# EAGLE design water_controller (EAGLE 6.4)
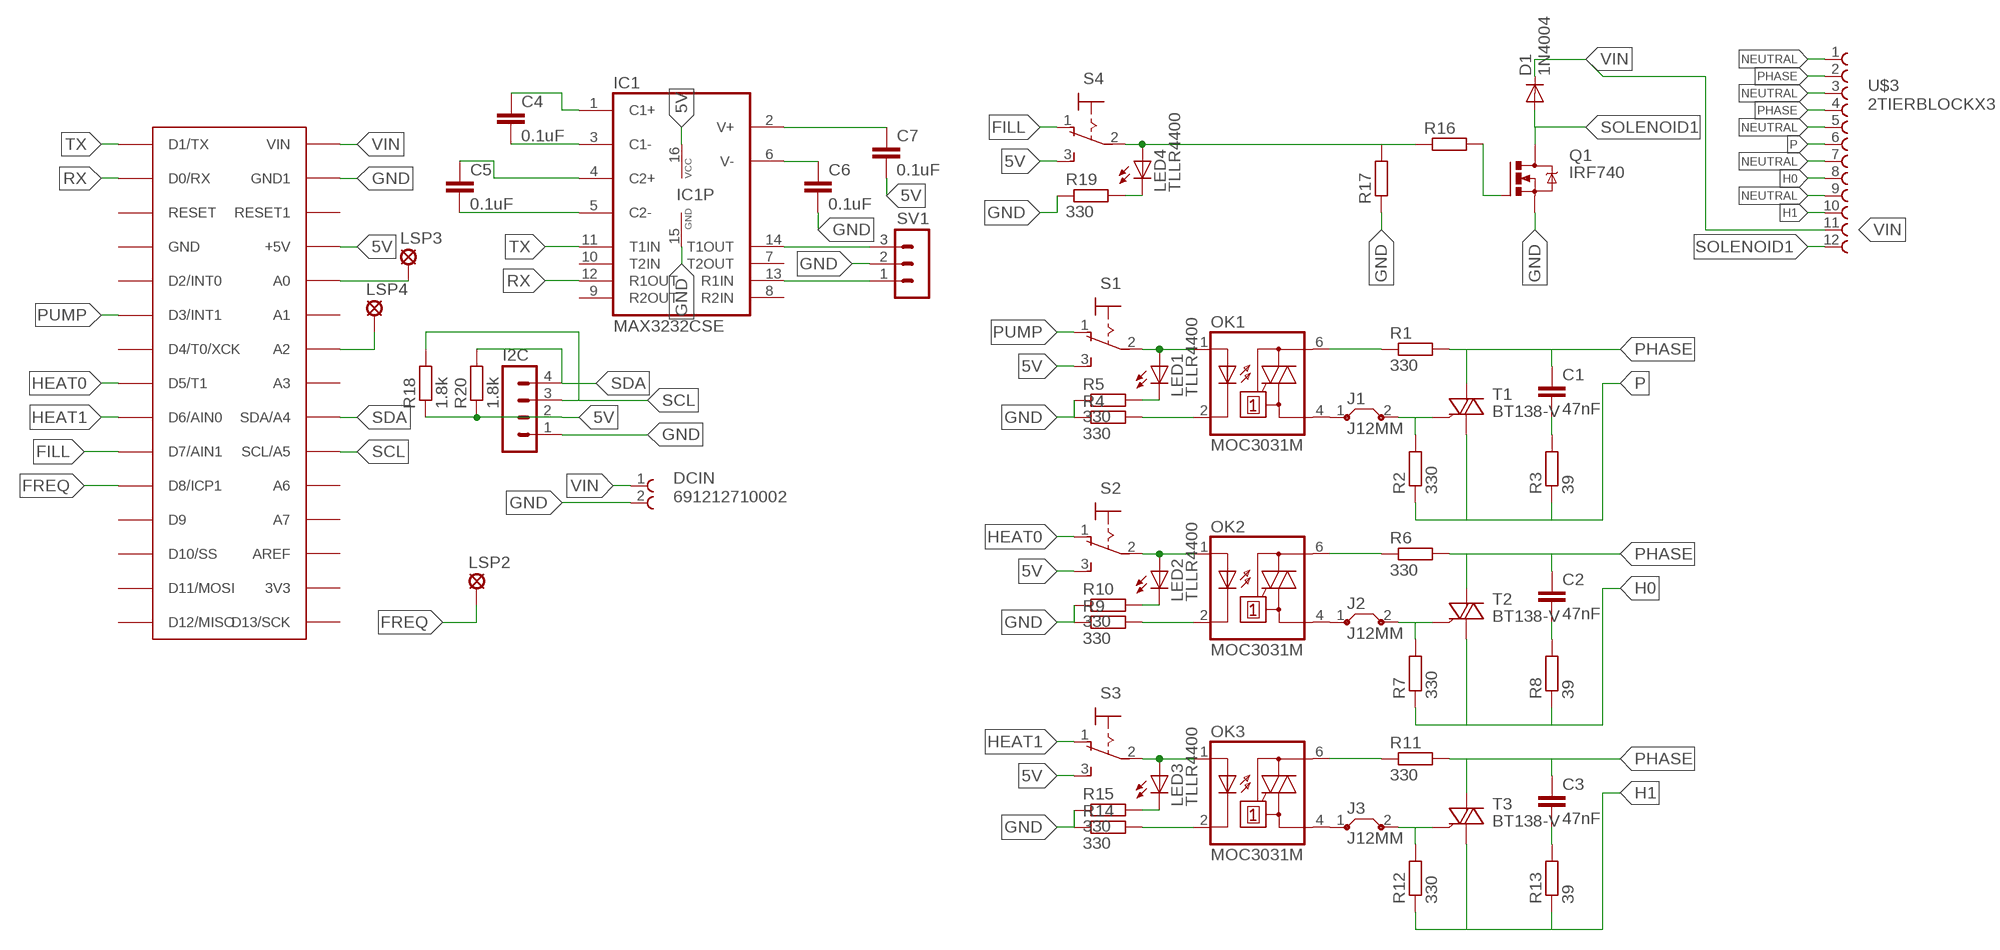
[diagram p0: schematic, sheet 1]

## Parts
C1  47nF  C-EU150-064X183  [C150-064X183]
C2  47nF  C-EU150-064X183  [C150-064X183]
C3  47nF  C-EU150-064X183  [C150-064X183]
C4  0.1uF  C-EUC0805  [C0805]
C5  0.1uF  C-EUC0805  [C0805]
C6  0.1uF  C-EUC0805  [C0805]
C7  0.1uF  C-EUC0805  [C0805]
D1  1N4004  [DO41-10]
DCIN  691212710002  [691212710002]
I2C  MA04-1  [MA04-1]
IC1  MAX3232CSE  [SO16]
J1  J12MM  [12]
J2  J12MM  [12]
J3  J12MM  [12]
LED1  TLLR4400  [LED3MM]
LED2  TLLR4400  [LED3MM]
LED3  TLLR4400  [LED3MM]
LED4  TLLR4400  [LED3MM]
LSP2  LSP11  [LSP11]
LSP3  LSP11  [LSP11]
LSP4  LSP11  [LSP11]
OK1  MOC3031M  [DIL06]
OK2  MOC3031M  [DIL06]
OK3  MOC3031M  [DIL06]
Q1  IRF740  [TO220BV]
R1  330  R-EU_M1206  [M1206]
R2  330  R-EU_M1206  [M1206]
R3  39  R-EU_M1206  [M1206]
R4  330  R-EU_R1206  [R1206]
R5  330  R-EU_R1206  [R1206]
R6  330  R-EU_M1206  [M1206]
R7  330  R-EU_M1206  [M1206]
R8  39  R-EU_M1206  [M1206]
R9  330  R-EU_R1206  [R1206]
R10  330  R-EU_R1206  [R1206]
R11  330  R-EU_M1206  [M1206]
R12  330  R-EU_M1206  [M1206]
R13  39  R-EU_M1206  [M1206]
R14  330  R-EU_R1206  [R1206]
R15  330  R-EU_R1206  [R1206]
R16  R-EU_0204/7  [0204/7]
R17  R-EU_M1206  [M1206]
R18  1.8k  R-EU_R1206  [R1206]
R19  330  R-EU_R1206  [R1206]
R20  1.8k  R-EU_R1206  [R1206]
S1  M9040P  [M9040P]
S2  M9040P  [M9040P]
S3  M9040P  [M9040P]
S4  M9040P  [M9040P]
SV1  MA03-1  [MA03-1]
T1  BT138-V  [TO220BV]
T2  BT138-V  [TO220BV]
T3  BT138-V  [TO220BV]
U$1  ARDUINONANO  [PDIP-32]
U$3  2TIERBLOCKX3  [2TIERX3]

## Nets
5V: C7.2 I2C.2 IC1.16(VCC) R18.1 R20.1 S1.3(S) S2.3(S) S3.3(S) S4.3(S) U$1.+5V
FILL: S4.1(O) U$1.D7(D7/AIN1)
FREQ: LSP2.MP U$1.D8(D8/ICP1)
GND: C6.2 DCIN.2 I2C.1 IC1.15(GND) Q1.S R4.1 R5.1 R9.1 R10.1 R14.1 R15.1 R17.1 R19.1 SV1.2 U$1.GND1
H0: R7.1 R8.1 T2.T1(A1) U$3.8
H1: R12.1 R13.1 T3.T1(A1) U$3.10
HEAT0: S2.1(O) U$1.D5(D5/T1)
HEAT1: S3.1(O) U$1.D6(D6/AIN0)
N$1: C1.2 R3.2
N$2: C2.2 R8.2
N$3: OK1.6(A2) R1.1
N$4: J1.2 R2.2 T1.G
N$5: C4.2 IC1.3(C1-)
N$6: OK1.2(C) R4.2
N$7: LED1.A OK1.1(A) S1.2(P)
N$8: LED1.K(C) R5.2
N$9: C4.1 IC1.1(C1+)
N$10: OK2.6(A2) R6.1
N$11: J2.2 R7.2 T2.G
N$12: OK2.2(C) R9.2
N$13: LED2.A OK2.1(A) S2.2(P)
N$14: LED2.K(C) R10.2
N$15: C3.2 R13.2
N$16: OK3.6(A2) R11.1
N$17: J3.2 R12.2 T3.G
N$18: OK3.2(C) R14.2
N$19: LED3.A OK3.1(A) S3.2(P)
N$20: LED3.K(C) R15.2
N$21: C5.2 IC1.5(C2-)
N$22: Q1.G R16.2
N$23: C5.1 IC1.4(C2+)
N$24: LED4.A R16.1 R17.2 S4.2(P)
N$25: LED4.K(C) R19.2
N$26: C6.1 IC1.6(V-)
N$27: C7.1 IC1.2(V+)
N$28: J1.1 OK1.4(A1)
N$29: J2.1 OK2.4(A1)
N$30: J3.1 OK3.4(A1)
N$31: IC1.13(R1IN) SV1.1
N$32: IC1.14(T1OUT) SV1.3
N$33: LSP4.MP U$1.A2
N$34: LSP3.MP U$1.A0
NEUTRAL: U$3.1 U$3.3 U$3.5 U$3.7 U$3.9
P: R2.1 R3.1 T1.T1(A1) U$3.6
PHASE: C1.1 C2.1 C3.1 R1.2 R6.2 R11.2 T1.T2(A2) T2.T2(A2) T3.T2(A2) U$3.2 U$3.4
PUMP: S1.1(O) U$1.D3(D3/INT1)
RX: IC1.12(R1OUT) U$1.D0/RX
SCL: I2C.3 R18.2 U$1.A5(SCL/A5)
SDA: I2C.4 R20.2 U$1.A4(SDA/A4)
SOLENOID1: D1.A Q1.D U$3.12
TX: IC1.11(T1IN) U$1.D1/TX
VIN: D1.C DCIN.1 U$1.VIN U$3.11
Unconnected: IC1.7(T2OUT) IC1.8(R2IN) IC1.9(R2OUT) IC1.10(T2IN) U$1.3V3 U$1.A1 U$1.A3 U$1.A6 U$1.A7 U$1.AREF U$1.D2(D2/INT0) U$1.D4(D4/T0/XCK) U$1.D9 U$1.D10(D10/SS) U$1.D11(D11/MOSI) U$1.D12(D12/MISO) U$1.D13(D13/SCK) U$1.GND U$1.RESET U$1.RESET1

## Library data of the parts
C1-C7 = rcl:C-EU: CAPACITOR, European symbol
D1 = diode:1N4004: DIODE general purpose rectifier, 1 A
DCIN = ZugbuegelsystemWR-TBL:691212710002: WR-TBL Serie 212 - 5.0mm 45° Entry Modular with Rising Cage Clamp - 3.5mm2 Wires, 2 Pins
I2C = con-lstb:MA04-1: PIN HEADER; OC_FARNELL: unknown; OC_NEWARK: unknown
IC1 = maxim:MAX3232*: True RS-232 Transceivers 3.0V to 5.5V, Low-Power up to 1Mbps, Using Four 0.1µF External Capacitors Source: http://pdfserv.maxim-ic.com/en/ds/MAX3222-MAX3241.pdf; MPN: MAX3232CSE; OC_FARNELL: 9725490; OC_NEWARK: 90C2890
J1-J3 = jumper:J: Bridge
LED1-LED4 = led:TLLR4400: Low Current (2mA) LED 3 mm Tinted Diffused Package color RED Source: Data sheet <http://www.farnell.com/datasheets/391100.pdf>; MF: VISHAY SEMICONDUCTOR; OC_FARNELL: 1612437
LSP2-LSP4 = solpad:LSP11: SOLDER PAD drill 1.1 mm
OK1-OK3 = optocoupler:MOC30*: 6-Pin DIP Zero-Cross Optoisolators Triac Driver Output (250/400 Volt Peak) Source: http://www.fairchildsemi.com/ds/MO/MOC3043-M.pdf; MF: FAIRCHILD SEMICONDUCTOR; MPN: MOC3063; OC_FARNELL: 9875964; OC_NEWARK: 78K6089
Q1 = transistor-power:IRF740: N-CHANNEL MOS FET
R1-R17 R19 = rcl:R-EU_: RESISTOR, European symbol
R18 R20 = resistor:R-EU_: RESISTOR, European symbol
S1-S4 = switch:M9040P: TOGGLE SWITCH Marquardt
SV1 = con-lstb:MA03-1: PIN HEADER; OC_FARNELL: unknown; OC_NEWARK: unknown
T1-T3 = triac:BT138: TRIAC Source: http://www.semiconductors.philips.com BT138_SERIES_2.pdf
U$1 = jet-lib:ARDUINONANO
U$3 = jet-lib:2TIERBLOCKX3

## Board
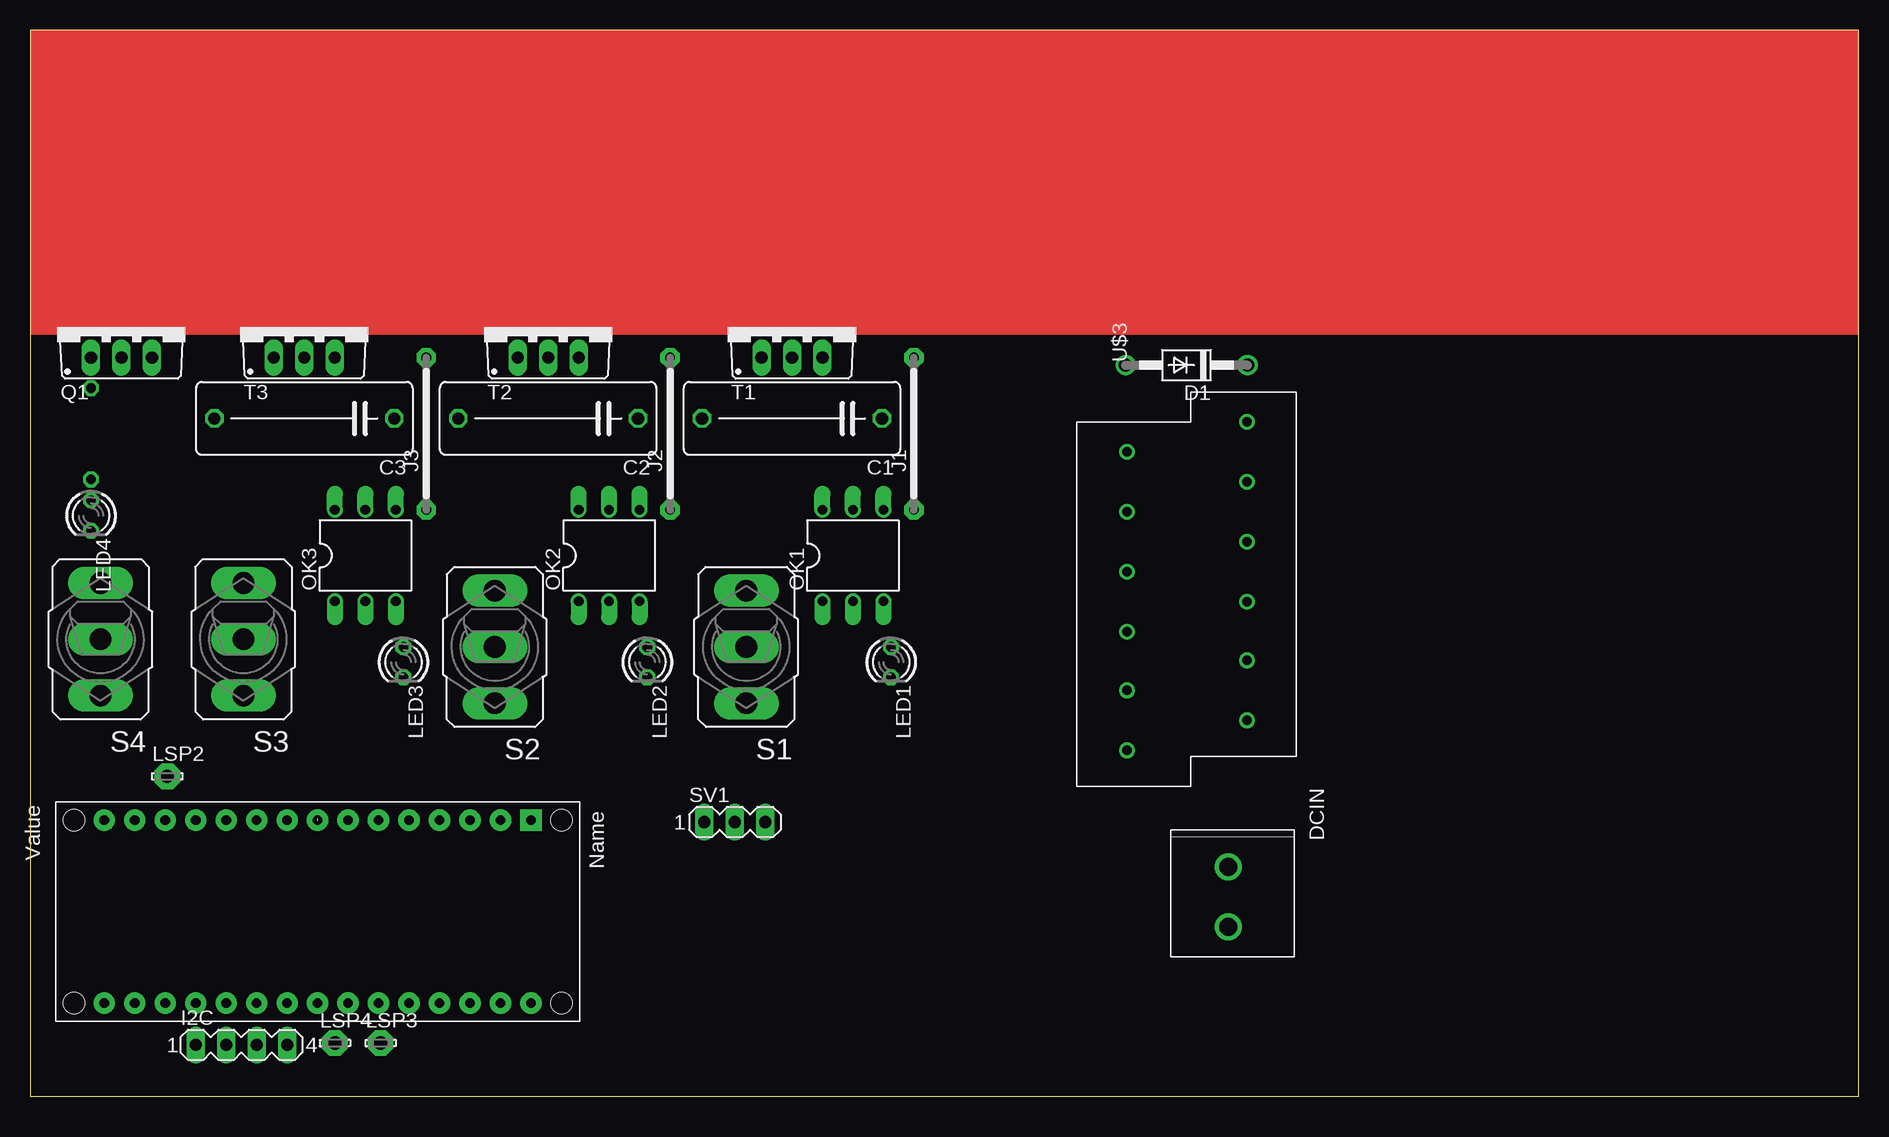
[diagram p1: board, top side]
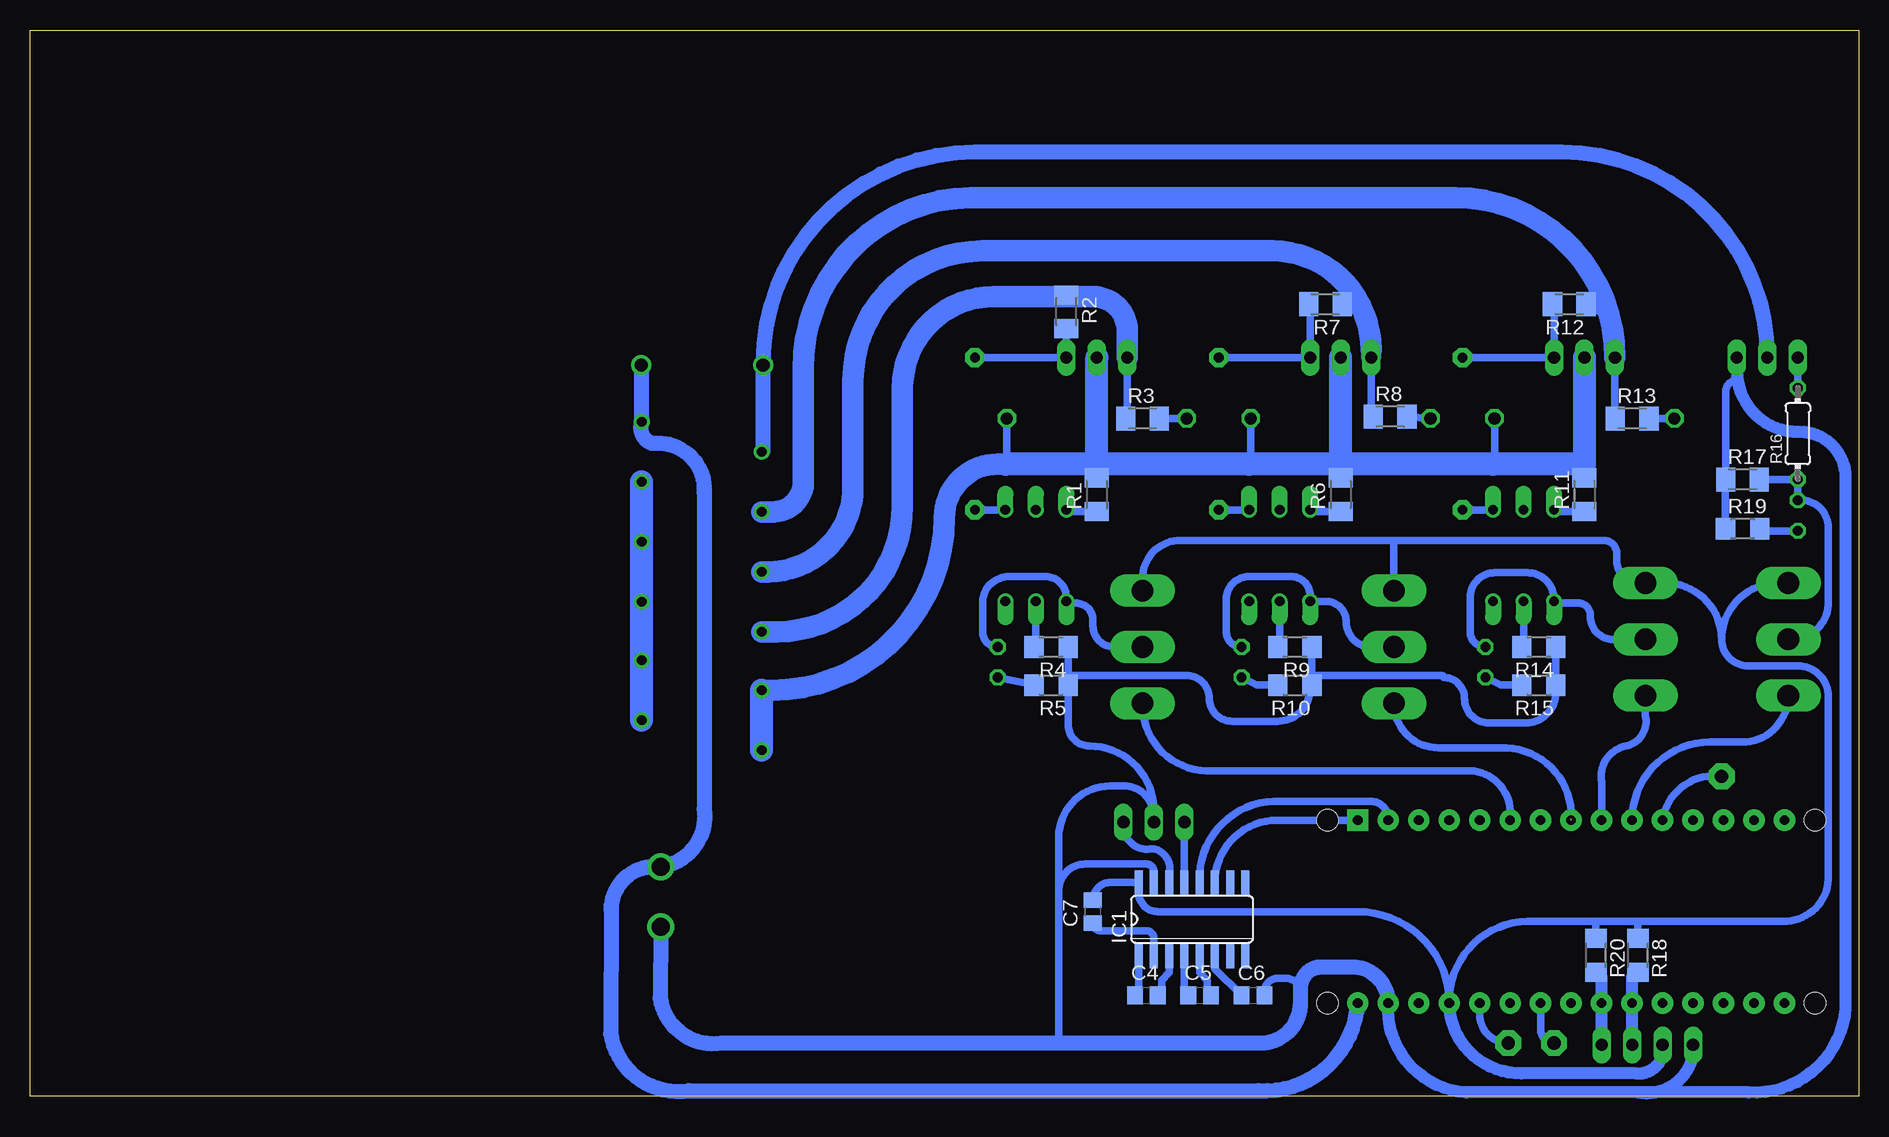
[diagram p2: board, bottom side, seen from below]

Size 152.4 x 88.9 mm. Coordinates in mm from the lower left corner, seen from the top.
Outline: 0,0 152.4,0 152.4,88.9 0,88.9 0,0
Copper layers (1*16): Top 0.035mm / dielectric 1.5mm / Bottom 0.035mm
Design rules "default": minimum track width 10mil, minimum drill 24mil, track to track 8mil, track to pad 8mil, pad to pad 8mil, via to via 8mil, smd to smd 8mil, copper to edge 40mil, drill to drill 8mil, minimum pad ring 10mil, minimum via ring 8mil, stop-mask expansion 4mil, vias tented up to drill 0mil, thermal gap 10mil

### Footprints (pad centres in the part's own frame; a part is rotated, then mirrored left to right if it is on the bottom)
C150-064X183 = drill 1.016 octagon: 1 -7.493,0; 2 7.493,0
C0805 = smd 1.3 x 1.5: 1 -0.95,0; 2 0.95,0
DO41-10 = drill 1.118: A 5.08,0; C -5.08,0
691212710002 = drill 1.5: 1 -5,0; 2 0,0
MA04-1 = drill 1.016 long: 1 -3.81,0; 2 -1.27,0; 3 1.27,0; 4 3.81,0
SO16 = smd 0.66 x 2.032: 1 -4.445,-3.073; 2 -3.175,-3.073; 3 -1.905,-3.073; 4 -0.635,-3.073; 5 0.635,-3.073; 6 1.905,-3.073; 7 3.175,-3.073; 8 4.445,-3.073; 9 4.445,3.073; 10 3.175,3.073; 11 1.905,3.073; 12 0.635,3.073; 13 -0.635,3.073; 14 -1.905,3.073; 15 -3.175,3.073; 16 -4.445,3.073
12 = drill 0.813 pad 1.6 octagon: 1 -6.35,0; 2 6.35,0
LED3MM = drill 0.813 octagon: A -1.27,0; K 1.27,0
LSP11 = drill 1.118 pad 2.159 octagon: MP 0,0
DIL06 = drill 0.813 offset: 1 -2.54,-3.81; 2 0,-3.81; 3 2.54,-3.81; 4 2.54,3.81; 5 0,3.81; 6 -2.54,3.81
TO220BV = drill 1.016 long: D 0,-2.54; G -2.54,-2.54; S 2.54,-2.54
M1206 = smd 1.6 x 2: 1 -1.4,0; 2 1.4,0
R1206 = smd 1.6 x 1.803: 1 -1.422,0; 2 1.422,0
0204/7 = drill 0.813 octagon: 1 -3.81,0; 2 3.81,0
M9040P = drill 1.803 long: 1 0,4.699; 2 0,0; 3 0,-4.699
MA03-1 = drill 1.016 long: 1 -2.54,0; 2 0,0; 3 2.54,0
TO220BV' = drill 1.016 long: G 2.54,-2.54; T1 -2.54,-2.54; T2 0,-2.54
PDIP-32 = drill 0.8 pad 1.778: 3V3 15.24,-35.56; +5V 15.24,-10.16; A0 15.24,-12.7; A1 15.24,-15.24; A2 15.24,-17.78; A3 15.24,-20.32; A4 15.24,-22.86; A5 15.24,-25.4; A6 15.24,-27.94; A7 15.24,-30.48; AREF 15.24,-33.02; D0/RX 0,-5.08; D2 0,-12.7; D3 0,-15.24; D4 0,-17.78; D5 0,-20.32; D6 0,-22.86; D7 0,-25.4; D8 0,-27.94; D9 0,-30.48; D10 0,-33.02; D11 0,-35.56; D12 0,-38.1; D13 15.24,-38.1; GND 0,-10.16; GND1 15.24,-5.08; RESET 0,-7.62; RESET1 15.24,-7.62; VIN 15.24,-2.54 | drill 0.8 pad 1.778 square: D1/TX 0,-2.54 | hole 1.778: 0,0; 0,-40.64; 15.24,-40.64; 15.24,0
2TIERX3 = drill 0.8: 1 0,0; 2 -2.5,10; 3 5,0; 4 2.5,10; 5 9.88,0; 6 7.38,10; 7 14.88,0; 8 12.38,10; 9 19.88,0; 10 17.38,10; 11 24.88,0; 12 22.38,10

### Placement (x,y rotation side)
C1  63.5,56.52 180 top
C2  43.18,56.52 180 top
C3  22.86,56.52 180 top
C4  59.37,8.41 0 bottom
C5  54.93,8.41 0 bottom
C6  50.48,8.41 0 bottom
C7  63.82,15.4 90 bottom
D1  96.38,60.96 180 top
DCIN  99.85,14.13 270 top
I2C  17.62,4.29 0 top
IC1  55.56,14.76 0 bottom
J1  73.66,55.24 90 top
J2  53.34,55.24 90 top
J3  33.02,55.24 90 top
LED1  71.75,36.2 270 top
LED2  51.44,36.2 270 top
LED3  31.11,36.2 270 top
LED4  5.08,48.42 270 top
LSP2  11.43,26.67 0 top
LSP3  29.21,4.45 0 top
LSP4  25.4,4.45 0 top
OK1  68.58,45.09 0 top
OK2  48.26,45.09 0 top
OK3  27.94,45.09 0 top
Q1  7.62,64.14 0 top
R1  63.5,50.16 90 bottom
R2  66.04,65.41 270 bottom
R3  59.69,56.52 0 bottom
R4  67.31,37.47 180 bottom
R5  67.31,34.29 180 bottom
R6  43.18,50.16 90 bottom
R7  44.45,66.04 180 bottom
R8  39.05,56.67 0 bottom
R9  46.99,37.47 180 bottom
R10  46.99,34.29 180 bottom
R11  22.86,50.16 90 bottom
R12  24.13,66.04 180 bottom
R13  18.89,56.52 0 bottom
R14  26.67,37.47 180 bottom
R15  26.67,34.29 180 bottom
R16  5.08,55.24 90 bottom
R17  9.68,51.44 0 bottom
R18  18.41,11.75 270 bottom
R19  9.68,47.31 0 bottom
R20  21.91,11.75 270 bottom
S1  59.69,37.47 180 top
S2  38.73,37.47 180 top
S3  17.78,38.1 180 top
S4  5.87,38.1 180 top
SV1  58.74,22.86 0 top
T1  BT138-V  [TO220BV']  63.5,64.14 0 top
T2  BT138-V  [TO220BV']  43.18,64.14 0 top
T3  BT138-V  [TO220BV']  22.86,64.14 0 top
U$1  44.29,23.02 270 top
U$3  101.42,31.34 90 top

### Tracks (layer width: path | path; a pad name or v marks a point on that pad's centre or on a via)
5V
  Bottom 0.61: S1.3 59.69,43.18 arc90 56.52,46.35 38.73,46.35 | S2.3 38.73,46.35 | 11.43,38.1 arc-90 16.13,42.8 S3.3 18.35,42.8 arc90 20.16,44.61 20.16,45.24 arc-90 21.27,46.35 38.73,46.35 | 11.43,38.1 arc-90 9.21,35.88 5.08,35.88 arc90 2.54,33.34 2.54,18.1 arc90 6.35,14.61 18.73,14.61 | 18.73,14.61 21.91,14.61 | 21.91,14.61 27.62,14.61 arc-90 U$1.+5V arc-90 41.75,15.4 58.42,15.4 arc90 60.01,16.99 IC1.16 62.33,17.84 arc-90 C7.2 | S4.3 6.73,42.8 arc-90 11.43,38.1 | R18.1 18.41,14.29 arc-90 18.73,14.61 | R20.1 21.91,14.61
  Bottom 1.016: I2C.2 16.35,3.65 arc90 18.57,1.91 28.1,1.91 arc90 U$1.+5V
FILL
  Bottom 0.61: U$1.D7 arc90 12.38,29.53 9.75,29.53 arc-90 S4.1
FREQ
  Bottom 0.61: U$1.D8 U$1.D8 arc90 LSP2.MP
GND
  Bottom 0.61: 65.89,35.08 R4.1 65.41,37.47 | 65.89,35.08 R5.1 65.89,33.66 arc-90 65.88,33.66 65.88,30.96 arc-90 64.14,29.21 arc90 58.74,23.81 SV1.2 58.74,23.34 arc-90 61.28,25.88 62.39,25.88 arc-90 66.67,21.59 66.67,17.14 | 45.57,35.08 R9.1 45.09,37.47 | 45.57,35.08 R10.1 45.72,34.14 45.72,33.97 arc90 48.42,31.27 52.23,31.27 arc90 54.13,33.18 arc-90 56.04,35.08 65.89,35.08 | 25.4,34.14 R15.1 | R15.1 25.24,33.66 arc90 27.78,31.11 30.8,31.11 arc90 32.86,33.18 arc-90 34.61,34.92 arc-90 34.77,35.08 45.57,35.08 | R15.1 R14.1 | R19.1 arc90 R19.1 11.11,51.12 arc-90 11.08,51.15 R17.1 11.08,58.77 arc90 10.16,59.69 10.16,60.48 | 66.67,17.14 66.67,4.6 arc-90 66.52,4.45 | IC1.15 58.74,18.73 arc-90 59.37,19.37 64.45,19.37 arc-90 66.67,17.14 | C6.2 49.53,8.73 arc90 48.42,9.84 47.78,9.84 arc90 46.51,8.57
  Bottom 1.016: I2C.1 13.81,3.49 arc90 18.41,0.32 | 18.41,0.32 32.7,0.32 arc90 U$1.GND1 | Q1.S 10.16,60.48 arc-90 5.08,55.4 4.92,55.4 arc90 1.11,51.59 1.11,7.46 arc90 9.21,0.32 18.41,0.32
  Bottom 1.27: DCIN.2 99.89,8.19 arc-90 94.77,4.45 66.52,4.45 49.85,4.45 arc-90 46.51,7.78 46.51,8.57 46.51,9.05 arc90 44.77,10.79 42.23,10.79 arc90 U$1.GND1
H0
  Bottom 0.61: T2.T1 40.64,57.02 R8.1
  Bottom 1.27: 40.64,62.23 40.64,63.63 arc-90 R7.1
  Bottom 1.676: T2.T1 40.64,62.23
  Bottom 1.778: U$3.8 90.89,43.73 arc-90 83.82,50.8 83.82,59.69 arc90 73.03,70.48 48.9,70.48 arc90 40.64,62.23
H1
  Bottom 0.61: T3.T1 20.32,57.02 R13.1
  Bottom 1.27: 21.27,66.36 arc90 21.59,66.04 R12.1 arc90 20.32,63.63 T3.T1
  Bottom 1.778: U$3.10 90.66,48.73 arc-90 87.95,51.12 87.95,60.64 arc90 73.98,74.93 33.66,74.93 arc90 T3.T1
HEAT0  (1 unrouted)
  Bottom 0.61: 23.97,23.18 arc-90 29.37,29.05 35.02,29.05 arc90 S2.1
HEAT1
  Bottom 0.61: S3.1 17.78,31.75 arc90 19.37,29.21 arc-90 21.43,26.19 U$1.D6
N$1
  Bottom 0.61: C1.2 R3.2
N$2
  Bottom 0.61: R8.2 C2.2
N$3
  Bottom 0.61: R1.1 66.04,48.77 OK1.6
N$4
  Bottom 0.61: R2.2 T1.G J1.2
N$5
  Bottom 0.305: 58.1,8.73 C4.2
  Bottom 0.61: IC1.3 57.47,10.32 58.1,9.68 58.1,8.73
N$6
  Bottom 0.61: OK1.2 68.58,37.62 R4.2
N$7
  Bottom 0.61: LED1.A arc90 73.03,38.73 73.03,41.12 arc90 70.8,43.34 67.79,43.34 arc90 66.04,41.59 OK1.1 arc-90 65.88,41.12 65.25,41.12 arc90 63.82,39.69 63.82,39.21 arc-90 62.07,37.47 S1.2
N$8
  Bottom 0.61: LED1.K R5.2
N$9
  Bottom 0.305: 60.01,8.73 C4.1
  Bottom 0.61: IC1.1 60.01,8.73
N$10
  Bottom 0.61: R6.1 45.59,48.77 OK2.6
N$11
  Bottom 0.61: J2.2 T2.G 45.72,65.91 R7.2
N$12
  Bottom 0.61: OK2.2 48.26,37.62 R9.2
N$13
  Bottom 0.61: S2.2 40.64,37.47 arc90 42.7,39.53 arc-90 44.45,41.27 OK2.1 45.72,41.75 arc-90 47.31,43.34 50.8,43.34 arc-90 52.7,41.43 52.7,38.73 arc-90 LED2.A
N$14
  Bottom 0.61: R10.2 50.16,34.29 LED2.K
N$15
  Bottom 0.61: R13.2 C3.2
N$16
  Bottom 0.61: R11.1 25.27,48.77 OK3.6
N$17
  Bottom 0.61: J3.2 T3.G 25.4,65.91 R12.2
N$18
  Bottom 0.61: OK3.2 27.94,37.62 R14.2
N$19
  Bottom 0.61: S3.2 20.48,38.1 arc90 22.38,40.01 22.38,40.16 arc-90 23.34,41.12 25.24,41.12 arc90 OK3.1 25.4,41.43 arc-90 27.62,43.66 30.32,43.66 arc-90 32.38,41.59 32.38,38.73 arc-90 LED3.A
N$20
  Bottom 0.61: R15.2 29.84,34.29 LED3.K
N$21
  Bottom 0.305: 54.29,8.73 C5.2
  Bottom 0.61: IC1.5 54.93,10.32 54.29,9.68 54.29,8.73
N$22
  Bottom 0.61: R16.2 Q1.G
N$23
  Bottom 0.305: 56.2,8.73 C5.1
  Bottom 0.61: IC1.4 56.2,8.73
N$24
  Bottom 0.61: R17.2 R16.1 LED4.A arc90 2.54,47.62 2.54,40.96 arc90 S4.2
N$25
  Bottom 0.61: LED4.K 8.1,47.15 arc90 R19.2
N$26
  Bottom 0.305: IC1.6 53.66,10.64
  Bottom 0.61: 53.66,10.64 C6.1
N$27
  Bottom 0.61: IC1.2 58.74,13.18 arc-90 59.37,13.81 63.18,13.81 arc90 C7.1
N$28
  Bottom 0.61: OK1.4 J1.1
N$29
  Bottom 0.61: OK2.4 J2.1
N$30
  Bottom 0.61: OK3.4 J3.1
N$31
  Bottom 0.61: SV1.1 IC1.13
N$32
  Bottom 0.61: SV1.3 61.28,22.23 arc-90 58.9,20.64 58.74,20.64 arc90 57.47,18.57 IC1.14
N$33
  Bottom 0.61: U$1.A2 26.51,5.56 arc-90 LSP4.MP
N$34
  Bottom 0.61: U$1.A0 31.59,6.83 arc-90 LSP3.MP
NEUTRAL
  Bottom 1.93: U$3.1 U$3.3 U$3.5 U$3.7 U$3.9
P
  Bottom 0.61: T1.T1 60.96,56.65 R3.1
  Bottom 1.27: R2.1 65.85,66.81 arc90 65.72,66.67
  Bottom 1.778: T1.T1 60.96,63.82 arc-90 63.82,66.67 65.72,66.67 72.07,66.67 arc-90 79.69,59.05 79.69,49.21 arc90 90.18,38.73 U$3.6
PHASE
  Bottom 0.61: C1.1 70.99,52.83 71.12,52.7 | C2.1 50.67,52.83 50.8,52.7 | R6.2 43.18,52.7 | R1.2 63.5,52.7 | C3.1 30.35,52.83 30.48,52.7 | 22.86,52.7 R11.2
  Bottom 1.778: U$3.4 90.61,33.84 arc-90 76.2,48.26 arc90 71.75,52.7 71.12,52.7
  Bottom 1.93: T3.T2 22.86,52.7 30.48,52.7 43.18,52.7 | 43.18,52.7 T2.T2 | 43.18,52.7 50.8,52.7 63.5,52.7 | 63.5,52.7 T1.T2 | 63.5,52.7 71.12,52.7 | U$3.2 U$3.4
PUMP
  Bottom 0.61: U$1.D3 29.05,23.5 arc-90 32.38,27.15 54.39,27.15 arc90 S1.1
RX
  Bottom 0.61: IC1.12 54.93,17.94 arc90 48.74,24.61 40.64,24.61 arc90 U$1.D0/RX
SCL
  Bottom 1.016: I2C.3 U$1.A5 18.89,9.85 arc90 R18.2
SDA
  Bottom 1.016: I2C.4 U$1.A4 21.43,9.85 arc-90 R20.2
SOLENOID1
  Bottom 1.27: U$3.12 arc-90 91.3,53.84 D1.A 91.3,61.1 arc90 73.66,78.74 24.77,78.74 arc90 Q1.D
TX
  Bottom 0.61: U$1.D1/TX 48.48,23.02 arc-90 IC1.11
VIN
  Bottom 1.27: U$1.VIN arc90 50.01,0.48 97.47,0.48 arc90 104.02,5.24 103.98,15.56 arc90 100.41,19.13 DCIN.1 arc-90 96.22,23.94 96.22,50.38 arc-90 99.83,54.45 100.59,54.45 arc90 U$3.11 101.42,60.92 arc-90 D1.C
(copper drawn outside any net)
  shapes: Top area x1